# EAGLE design v0.2.0 (EAGLE 9.2.0)

## Sheet 1 of 3
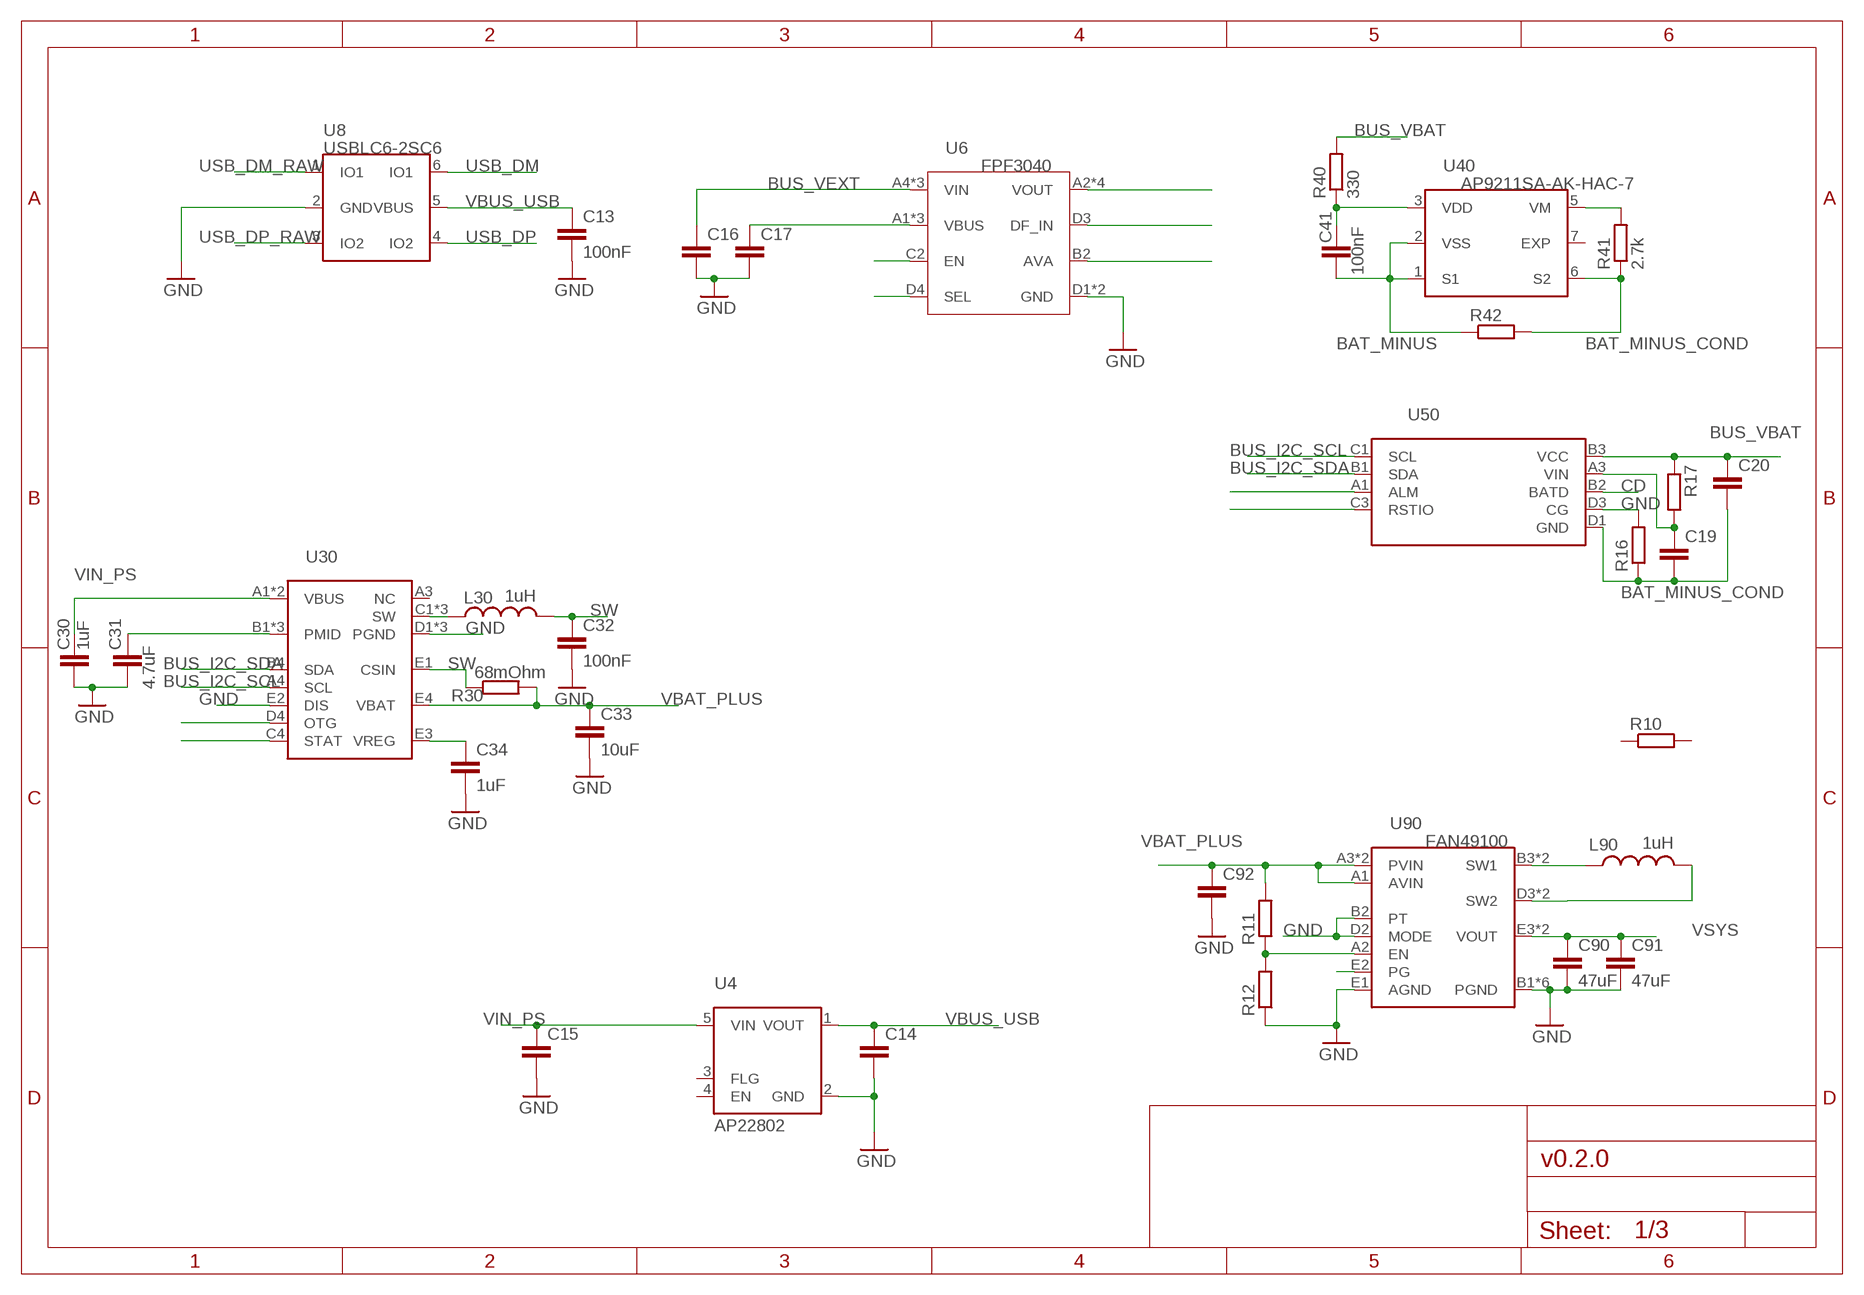
[diagram p0: schematic, sheet 1]

### Parts
C13  100nF  C-EUC0402  [C0402]
C14  C-EUC0603  [C0603]
C15  C-EUC0603  [C0603]
C16  C-EUC0603  [C0603]
C17  C-EUC0603  [C0603]
C19  C-EUC0402  [C0402]
C20  C-EUC0402  [C0402]
C30  1uF  C-EUC0402  [C0402]
C31  4.7uF  C-EUC0603  [C0603]
C32  100nF  C-EUC0402  [C0402]
C33  10uF  C-EUC0603  [C0603]
C34  1uF  C-EUC0402  [C0402]
C41  100nF  C-EUC0402  [C0402]
C90  47uF  C-EUC0805  [C0805]
C91  47uF  C-EUC0805  [C0805]
C92  C-EUC0805  [C0805]
L30  1uH  DJNR3015  [L3230M]
L90  1uH  DJNR3015  [L3230M]
R10  R-EU_R0603  [R0603]
R11  R-EU_R0402  [R0402]
R12  R-EU_R0402  [R0402]
R16  R-EU_R0805  [R0805]
R17  R-EU_R0402  [R0402]
R30  68mOhm  R-EU_R0805  [R0805]
R40  330  R-EU_R0402  [R0402]
R41  2.7k  R-EU_R0402  [R0402]
R42  R-EU_R0603  [R0603]
U4  AP22802  [SOT25]
U6  FPF3040  [BGA16C40P4X4_196X176X60]
U8  USBLC6-2SC6  [SOT95P280X110-6]
U30  FAN54015  [BGA20C40P4X5_196X187X55]
U40  AP9211SA-AK-HAC-7  [DFN200X300X60-7N]
U50  STC3115  [BGA12C40P4X3_137X201X65]
U90  FAN49100  [BGA20C40P4X5_201X161X60]

### Nets
BAT_MINUS: C41.2 R42.1 U40.1(S1) U40.2(VSS)
BAT_MINUS_COND: C19.2 C20.2 R16.1 R41.1 R42.2 U40.6(S2) U50.D1(GND)
BUS_I2C_SCL: U30.A4(SCL) U50.C1(SCL) ; also sheet 2,3
BUS_I2C_SDA: U30.B4(SDA) U50.B1(SDA) ; also sheet 2,3
BUS_VBAT: C20.1 R17.1 R40.2 U50.B3(VCC) ; also sheet 2
BUS_VEXT: C16.1 U6.A4(VIN) U6.B4(VIN) U6.C4(VIN) ; also sheet 2
CD: U50.B2(BATD)
GND: C13.2 C14.2 C15.2 C16.2 C17.2 C30.2 C31.2 C32.2 C33.2 C34.2 C90.2 C91.2 C92.2 R12.1 R16.2 U4.2(GND) U6.D1(GND) U6.D2(GND) U8.2(GND) U30.D1(PGND) U30.D2(PGND) U30.D3(PGND) U30.E2(DIS) U50.D3(CG) U90.B1(PGND) U90.B2(PT) U90.C1(PGND) U90.C2(PGND) U90.C3(PGND) U90.C4(PGND) U90.D1(PGND) U90.D2(MODE) U90.E1(AGND) ; also sheet 2,3
N$3: C41.1 R40.1 U40.3(VDD)
N$6: U6.A2(VOUT) U6.A3(VOUT) U6.B3(VOUT) U6.C3(VOUT)
N$7: C17.1 U6.A1(VBUS) U6.B1(VBUS) U6.C1(VBUS)
N$11: U6.C2(EN)
N$12: U6.D4(SEL)
N$13: U6.B2(AVA)
N$14: U6.D3(DF_IN)
N$15: U50.A1(ALM)
N$16: U50.C3(RSTIO)
N$17: R41.2 U40.5(VM)
N$18: L30.1 U30.C1(SW) U30.C2(SW) U30.C3(SW)
N$19: C31.1 U30.B1(PMID) U30.B2(PMID) U30.B3(PMID)
N$20: L90.2 U90.D3(SW2) U90.D4(SW2)
N$21: L90.1 U90.B3(SW1) U90.B4(SW1)
N$22: C19.1 R17.2 U50.A3(VIN)
N$23: C34.1 U30.E3(VREG)
N$24: R11.1 R12.2 U90.A2(EN)
N$25: U90.E2(PG)
N$28: U30.D4(OTG)
N$29: U30.C4(STAT)
SW: C32.1 L30.2 R30.1 U30.E1(CSIN)
USB_DM: U8.6(IO1) ; also sheet 3
USB_DM_RAW: U8.1(IO1) ; also sheet 2
USB_DP: U8.4(IO2) ; also sheet 3
USB_DP_RAW: U8.3(IO2) ; also sheet 2
VBAT_PLUS: C33.1 C92.1 R11.2 R30.2 U30.E4(VBAT) U90.A1(AVIN) U90.A3(PVIN) U90.A4(PVIN)
VBUS_USB: C13.1 C14.1 U4.1(VOUT) U8.5(VBUS) ; also sheet 2
VIN_PS: C15.1 C30.1 U4.5(VIN) U30.A1(VBUS) U30.A2(VBUS)
VSYS: C90.1 C91.1 U90.E3(VOUT) U90.E4(VOUT)
Unconnected: R10.1 R10.2 U4.3(FLG) U4.4(EN) U30.A3(NC)

## Sheet 2 of 3
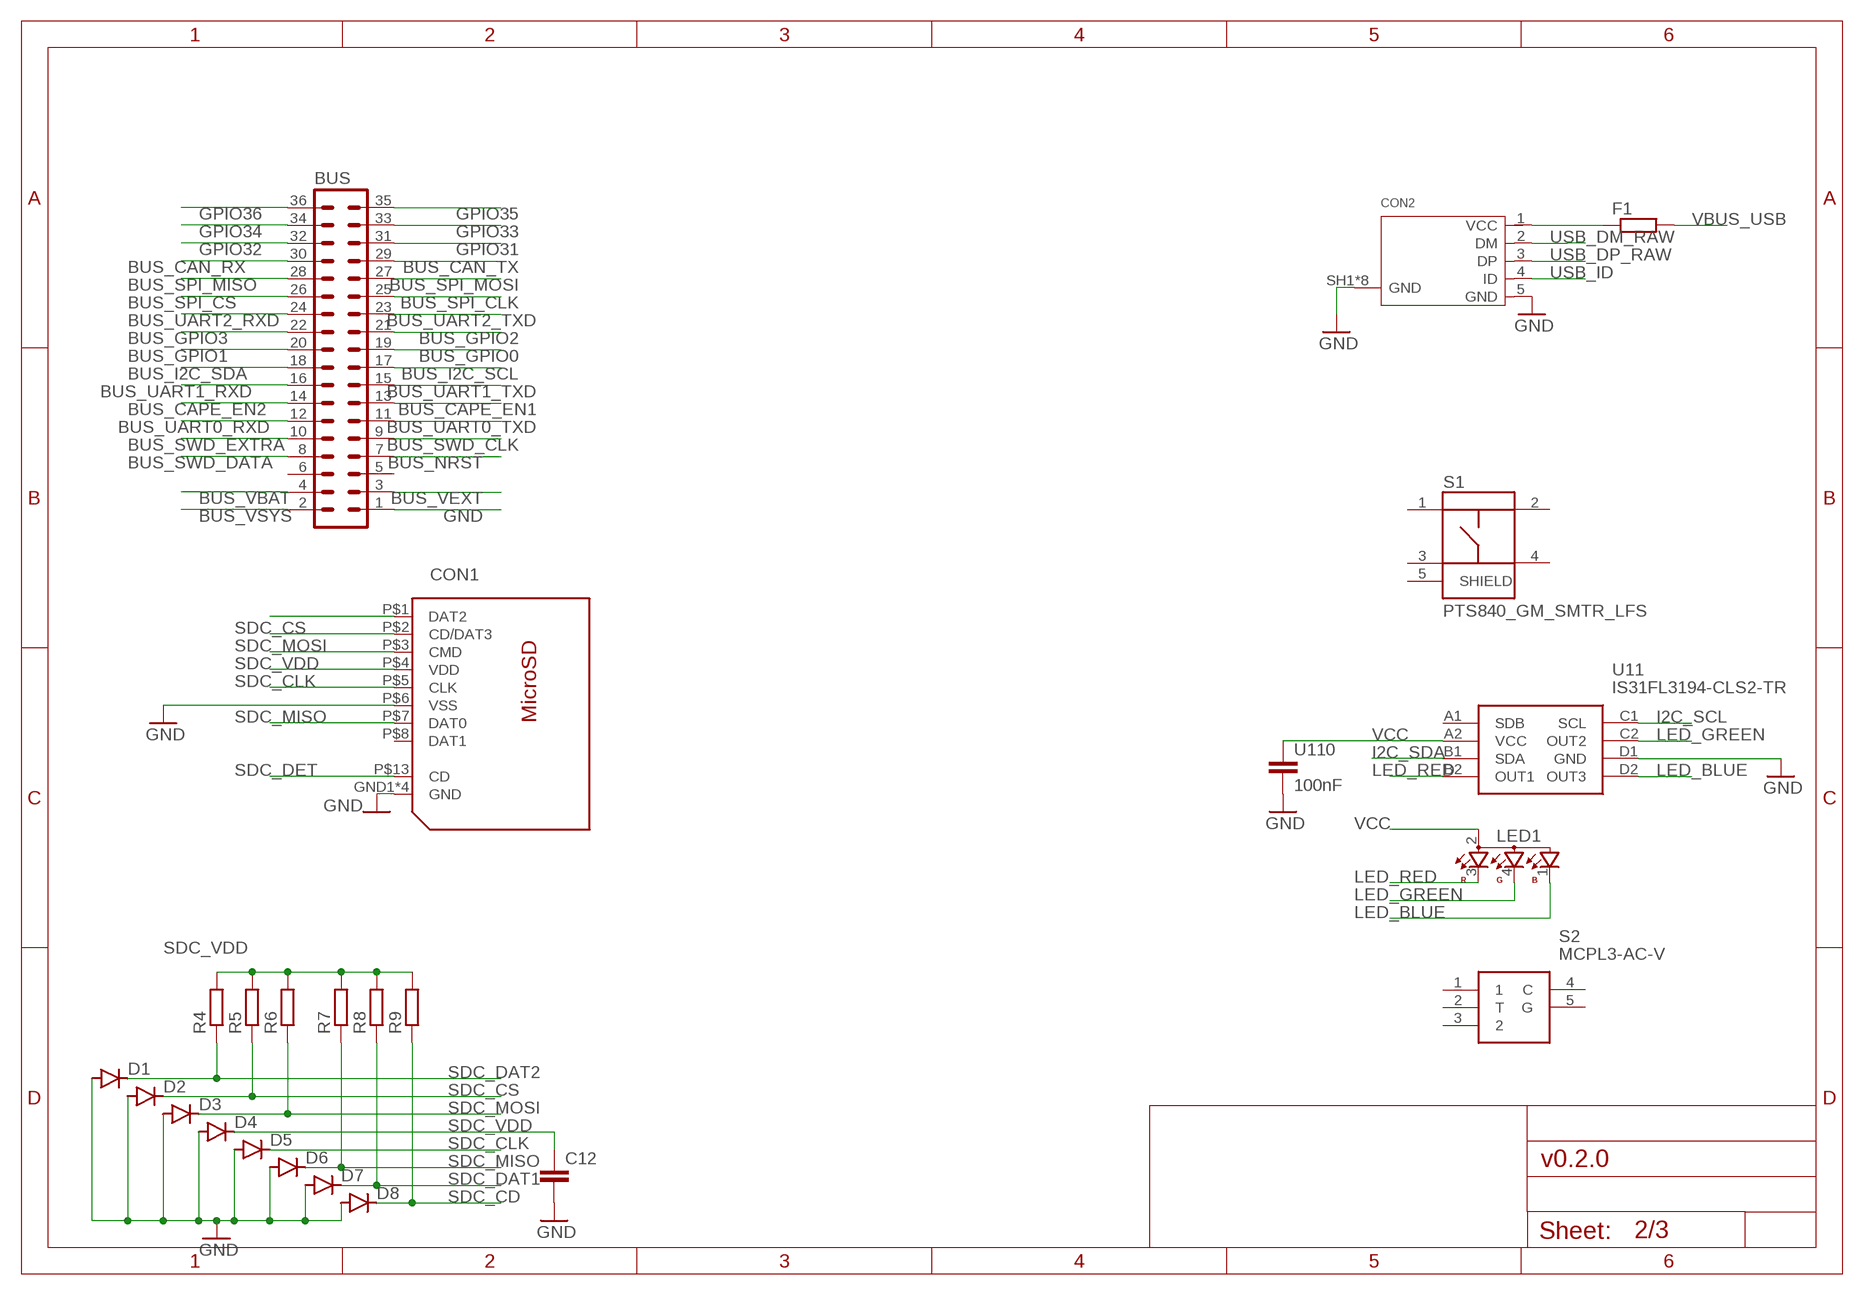
[diagram p1: schematic, sheet 2]

### Parts
BUS  MA18-2  [MA18-2]
C12  C-EUC0402  [C0402]
CON1  112J-TXAR  [112J]
CON2  10118194-0001LF  [10118194]
D1  DIODE-SOD523  [SOD523]
D2  DIODE-SOD523  [SOD523]
D3  DIODE-SOD523  [SOD523]
D4  DIODE-SOD523  [SOD523]
D5  DIODE-SOD523  [SOD523]
D6  DIODE-SOD523  [SOD523]
D7  DIODE-SOD523  [SOD523]
D8  DIODE-SOD523  [SOD523]
F1  R-EU_R0603  [R0603]
LED1  OSTB1204C1E  [321015RGB]
R4  R-EU_R0402  [R0402]
R5  R-EU_R0402  [R0402]
R6  R-EU_R0402  [R0402]
R7  R-EU_R0402  [R0402]
R8  R-EU_R0402  [R0402]
R9  R-EU_R0402  [R0402]
S1  PTS840_GM_SMTR_LFS  [SW_PTS840GMSMTRLFS]
S2  MCPL3-AC-V  [MCPL3-AC-V]
U11  IS31FL3194-CLS2-TR  [BGA8C40P2X4_99X159X42]
U110  100nF  C-EUC0402  [C0402]

### Nets
BUS_CAN_RX: BUS.30
BUS_CAN_TX: BUS.29
BUS_CAPE_EN1: BUS.13 ; also sheet 3
BUS_CAPE_EN2: BUS.14 ; also sheet 3
BUS_GPIO0: BUS.19 ; also sheet 3
BUS_GPIO1: BUS.20 ; also sheet 3
BUS_GPIO2: BUS.21 ; also sheet 3
BUS_GPIO3: BUS.22 ; also sheet 3
BUS_I2C_SCL: BUS.17 ; also sheet 1,3
BUS_I2C_SDA: BUS.18 ; also sheet 1,3
BUS_NRST: BUS.7 ; also sheet 3
BUS_SPI_CLK: BUS.25 ; also sheet 3
BUS_SPI_CS: BUS.26 ; also sheet 3
BUS_SPI_MISO: BUS.28 ; also sheet 3
BUS_SPI_MOSI: BUS.27 ; also sheet 3
BUS_SWD_CLK: BUS.9 ; also sheet 3
BUS_SWD_DATA: BUS.8 ; also sheet 3
BUS_SWD_EXTRA: BUS.10
BUS_UART0_RXD: BUS.12 ; also sheet 3
BUS_UART0_TXD: BUS.11 ; also sheet 3
BUS_UART1_RXD: BUS.16 ; also sheet 3
BUS_UART1_TXD: BUS.15 ; also sheet 3
BUS_UART2_RXD: BUS.24 ; also sheet 3
BUS_UART2_TXD: BUS.23 ; also sheet 3
BUS_VBAT: BUS.4 ; also sheet 1
BUS_VEXT: BUS.3 ; also sheet 1
BUS_VSYS: BUS.2
GND: BUS.1 C12.2 CON1.GND1(GND) CON1.GND2(GND) CON1.GND3(GND) CON1.GND4(GND) CON1.P$6(VSS) CON2.5(GND) CON2.SH1(GND) CON2.SH2(GND) CON2.SH3(GND) CON2.SH4(GND) CON2.SH5(GND) CON2.SH6(GND) CON2.SH7(GND) CON2.SH8(GND) D1.A D2.A D3.A D4.A D5.A D6.A D7.A D8.A U11.D1(GND) U110.2 ; also sheet 1,3
GPIO31: BUS.31 ; also sheet 3
GPIO32: BUS.32 ; also sheet 3
GPIO33: BUS.33 ; also sheet 3
GPIO34: BUS.34 ; also sheet 3
GPIO35: BUS.35 ; also sheet 3
GPIO36: BUS.36 ; also sheet 3
I2C_SCL: U11.C1(SCL)
I2C_SDA: U11.B1(SDA)
LED_BLUE: LED1.1 U11.D2(OUT3)
LED_GREEN: LED1.4 U11.C2(OUT2)
LED_RED: LED1.3 U11.B2(OUT1)
N$5: CON2.1(VCC) F1.1
N$9: CON1.P$1(DAT2)
SDC_CD: D8.C R9.1
SDC_CLK: CON1.P$5(CLK) D5.C ; also sheet 3
SDC_CS: CON1.P$2(CD/DAT3) D2.C R5.1 ; also sheet 3
SDC_DAT1: D7.C R8.1
SDC_DAT2: D1.C R4.1
SDC_DET: CON1.P$13(CD)
SDC_MISO: CON1.P$7(DAT0) D6.C R7.1 ; also sheet 3
SDC_MOSI: CON1.P$3(CMD) D3.C R6.1 ; also sheet 3
SDC_VDD: C12.1 CON1.P$4(VDD) D4.C R4.2 R5.2 R6.2 R7.2 R8.2 R9.2
USB_DM_RAW: CON2.2(DM) ; also sheet 1
USB_DP_RAW: CON2.3(DP) ; also sheet 1
USB_ID: CON2.4(ID)
VBUS_USB: F1.2 ; also sheet 1
VCC: LED1.2 U11.A2(VCC) U110.1
Unconnected: BUS.5 BUS.6 CON1.P$8(DAT1) S1.1 S1.2 S1.3 S1.4 S1.5(SHIELD) S2.1 S2.2(T) S2.3 S2.4(C) S2.5(G) U11.A1(SDB)

## Sheet 3 of 3
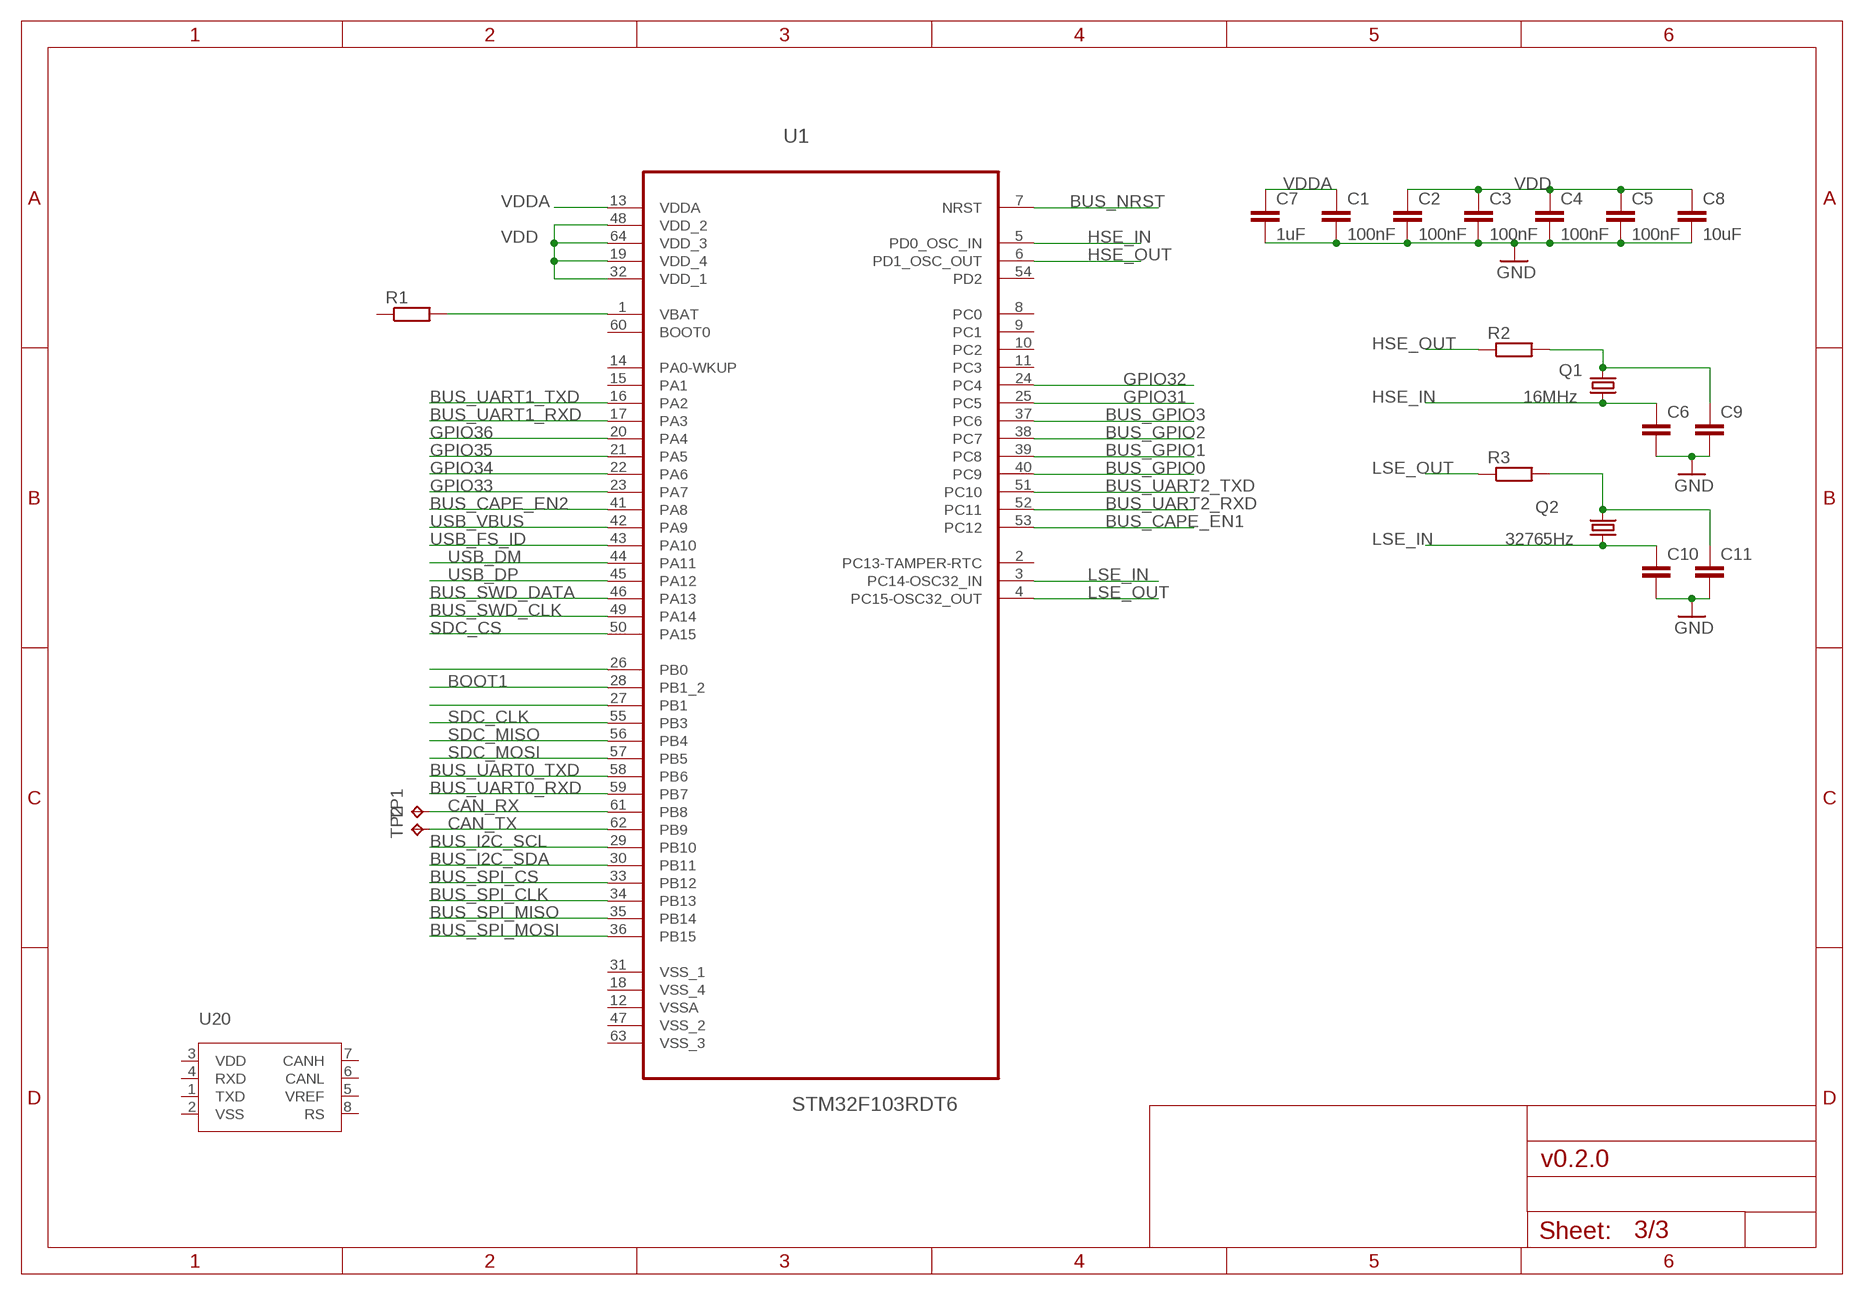
[diagram p2: schematic, sheet 3]

### Parts
C1  100nF  C-EUC0402  [C0402]
C2  100nF  C-EUC0402  [C0402]
C3  100nF  C-EUC0402  [C0402]
C4  100nF  C-EUC0402  [C0402]
C5  100nF  C-EUC0402  [C0402]
C6  C-EUC0402  [C0402]
C7  1uF  C-EUC0402  [C0402]
C8  10uF  C-EUC0603  [C0603]
C9  C-EUC0402  [C0402]
C10  C-EUC0402  [C0402]
C11  C-EUC0402  [C0402]
Q1  16MHz  KX-7  [3.2X2.5_KX-7]
Q2  32765Hz  KX-327-NHF  [3.2X1.5]
R1  R-EU_R0402  [R0402]
R2  R-EU_R0402  [R0402]
R3  R-EU_R0402  [R0402]
TP1  TPB1,27  [B1,27]
TP2  TPB1,27  [B1,27]
U1  STM32F103RDT6  [QFP50P1200X1200X160-64N]
U20  MCP2551  [SOIC8]

### Nets
BOOT1: U1.28(PB1_2)
BUS_CAPE_EN1: U1.53(PC12) ; also sheet 2
BUS_CAPE_EN2: U1.41(PA8) ; also sheet 2
BUS_GPIO0: U1.40(PC9) ; also sheet 2
BUS_GPIO1: U1.39(PC8) ; also sheet 2
BUS_GPIO2: U1.38(PC7) ; also sheet 2
BUS_GPIO3: U1.37(PC6) ; also sheet 2
BUS_I2C_SCL: U1.29(PB10) ; also sheet 1,2
BUS_I2C_SDA: U1.30(PB11) ; also sheet 1,2
BUS_NRST: U1.7(NRST) ; also sheet 2
BUS_SPI_CLK: U1.34(PB13) ; also sheet 2
BUS_SPI_CS: U1.33(PB12) ; also sheet 2
BUS_SPI_MISO: U1.35(PB14) ; also sheet 2
BUS_SPI_MOSI: U1.36(PB15) ; also sheet 2
BUS_SWD_CLK: U1.49(PA14) ; also sheet 2
BUS_SWD_DATA: U1.46(PA13) ; also sheet 2
BUS_UART0_RXD: U1.59(PB7) ; also sheet 2
BUS_UART0_TXD: U1.58(PB6) ; also sheet 2
BUS_UART1_RXD: U1.17(PA3) ; also sheet 2
BUS_UART1_TXD: U1.16(PA2) ; also sheet 2
BUS_UART2_RXD: U1.52(PC11) ; also sheet 2
BUS_UART2_TXD: U1.51(PC10) ; also sheet 2
CAN_RX: TP1.TP U1.61(PB8)
CAN_TX: TP2.TP U1.62(PB9)
GND: C1.2 C2.2 C3.2 C4.2 C5.2 C6.2 C7.2 C8.2 C9.2 C10.2 C11.2 ; also sheet 1,2
GPIO31: U1.25(PC5) ; also sheet 2
GPIO32: U1.24(PC4) ; also sheet 2
GPIO33: U1.23(PA7) ; also sheet 2
GPIO34: U1.22(PA6) ; also sheet 2
GPIO35: U1.21(PA5) ; also sheet 2
GPIO36: U1.20(PA4) ; also sheet 2
HSE_IN: C6.1 Q1.1 U1.5(PD0_OSC_IN)
HSE_OUT: R2.1 U1.6(PD1_OSC_OUT)
LSE_IN: C10.1 Q2.1 U1.3(PC14-OSC32_IN)
LSE_OUT: R3.1 U1.4(PC15-OSC32_OUT)
N$1: R1.2 U1.1(VBAT)
N$2: C9.1 Q1.3 R2.2
N$4: C11.1 Q2.2 R3.2
N$8: U1.26(PB0)
N$10: U1.27(PB1)
SDC_CLK: U1.55(PB3) ; also sheet 2
SDC_CS: U1.50(PA15) ; also sheet 2
SDC_MISO: U1.56(PB4) ; also sheet 2
SDC_MOSI: U1.57(PB5) ; also sheet 2
USB_DM: U1.44(PA11) ; also sheet 1
USB_DP: U1.45(PA12) ; also sheet 1
USB_FS_ID: U1.43(PA10)
USB_VBUS: U1.42(PA9)
VDD: C2.1 C3.1 C4.1 C5.1 C8.1 U1.19(VDD_4) U1.32(VDD_1) U1.48(VDD_2) U1.64(VDD_3)
VDDA: C1.1 C7.1 U1.13(VDDA)
Unconnected: R1.1 U1.2(PC13-TAMPER-RTC) U1.8(PC0) U1.9(PC1) U1.10(PC2) U1.11(PC3) U1.12(VSSA) U1.14(PA0-WKUP) U1.15(PA1) U1.18(VSS_4) U1.31(VSS_1) U1.47(VSS_2) U1.54(PD2) U1.60(BOOT0) U1.63(VSS_3) U20.1(TXD) U20.2(VSS) U20.3(VDD) U20.4(RXD) U20.5(VREF) U20.6(CANL) U20.7(CANH) U20.8(RS)

## Power pins joined to a net without a drawn wire
EXP: U40.7(EXP)

## Library data of the parts
BUS = con-lstb:MA18-2: PIN HEADER; OC_FARNELL: unknown; OC_NEWARK: unknown
C1-C17 C19 C20 C30-C34 C41 C90-C92 U110 = rcl:C-EU: CAPACITOR, European symbol; SPICEPREFIX: C
CON1 = parts-attend:112J-TXAR
CON2 = parts-amphenol:10118194-00
D1-D8 = diode:DIODE-: DIODE
F1 R1-R12 R16 R17 R30 R40-R42 = rcl:R-EU_: RESISTOR, European symbol; SPICEPREFIX: R
L30 L90 = parts-ferrocore:DJNR3015
LED1 = parts-optosupply:OSTB1204
Q1 = crystal-geyer_V1_0:KX: Quartz Crystals (MHz) SMD: KX - Serie Model Size l/w/h [mm] Frequency Range Frequency Stability Temp. Range [°C] Load Capacitance AECQ 200 availabel Datasheet KX-4 KX-5 KX-6 KX-7 KX-9A KX-9B KX-12A KX-12B KX-13 KX-20 KX-K KX-KS 1.6/1.2/0.3 2.0/1.6/0.45 2.5/2.0/0.55 3.2/2.5/0.8 5.0/3.2/1.0 5.0/3.2/1.1 6.0/3.5/1.1 6.0/3.5/1.0 7.0/5.0 /1.3 11.6/5.5/1.6 12.3/4.5/4.2 12.3/4.5/3.2 24.0 ~ 80.0 MHz 16.0 ~ 80.0 MHz 12.0 ~ 80.0 MHz 8.0 ~ 60.0 MHz 7,68 ~ 300,0 MHz 8,0 ~ 50,0 MHz 8,0 ~ 150,0 MHz 8,0 ~ 50,0 MHz 6,0 ~ 160,0 MHz 3,579 ~ 25,0 MHz 3,579 ~ 70,0 MHz 3,579 ~ 70,0 MHz ±10 … ±50ppm ±10 … ±50ppm ±10 … ±50ppm ±10 … ±50ppm ±10 … ±50ppm ±10 … ±50ppm ±10 … ±50ppm ±10 … ±50ppm ±10 … ±50ppm ±50ppm ±10 … ±50ppm ±10 … ±50ppm (*) -40°C …+85°C (*) -40°C …+125°C (*) -40°C …+125°C (*) -40°C …+125°C (*) -40°C …+105°C (*) -40°C …+105°C (*) -40°C …+125°C (*) -40°C …+105°C (*) -40°C …+105°C (*) -40°C …+105°C (*) -40°C …+85°C (*) -40°C …+85°C 8, 8…16 8, 8…16 10, 8…16 12, 7…20 16, 10…20 16, 10…20 16, 10…20 16, 12…20 16, 12…20 16, 12…20 16, 12…30 16, 12…30 - yes yes yes - - - - - - - - KX-4.pdf <http://www.geyer-electronic.de/uploads/tx_userartikelfrequenz/GEYER-KX-4.pdf> KX-5.pdf <http://www.geyer-electronic.de/uploads/tx_userartikelfrequenz/GEYER-KX-5.pdf> KX-6.pdf <http://www.geyer-electronic.de/uploads/tx_userartikelfrequenz/GEYER-KX-6.pdf> KX-7.pdf <http://www.geyer-electronic.de/uploads/tx_userartikelfrequenz/GEYER-KX-7.pdf> KX-9A.pdf <http://www.geyer-electronic.de/uploads/tx_userartikelfrequenz/GEYER-KX-9A.pdf> KX-9B.pdf <http://www.geyer-electronic.de/uploads/tx_userartikelfrequenz/GEYER-KX-9B.pdf> KX-12A.pdf <http://www.geyer-electronic.de/uploads/tx_userartikelfrequenz/GEYER-KX-12A.pdf> KX-12B.pdf <http://www.geyer-electronic.de/uploads/tx_userartikelfrequenz/GEYER-KX-12B.pdf> KX-13.pdf <http://www.geyer-electronic.de/uploads/tx_userartikelfrequenz/GEYER-KX-13.pdf> KX-20.pdf <http://www.geyer-electronic.de/uploads/tx_userartikelfrequenz/GEYER-KX-20.pdf> KX-K.pdf <http://www.geyer-electronic.de/uploads/tx_userartikelfrequenz/GEYER-KX-K.pdf> KX-KS.pdf <http://www.geyer-electronic.de/uploads/tx_userartikelfrequenz/GEYER-KX-KS.pdf> <http://www.geyer-electronic.de/fileadmin/template/img/logo-geyer-electronic.png> Details see: http://www.geyer-electronic.de/Frequenz-Produkte.9.0.html Created 2016-06-07, Hans Locher 2016 (C) Geyer Quartz Technology KX4,KX5,KX6,KX7,KX9A,KX9B,KX12A,KX12B,KX13,KX20,KXK,KXKS;1612;2016;2520;3225;5032;6035;7050;11655;12345;1,6x1,2;2,0x1,6;2,5x2,0;3,2x2,5;5,0x3,2;6,0x3,5;7,0x5,0;11,6x5,5;12,3x4,5;12,3x4,5;1.6x1.2;2.0x1.6;2.5x2.0;3.2x2.5;5.0x3.2;6.0x3.5;7.0x5.0;11.6x5.5;12.3x4.5;12.3x4.5;
Q2 = crystal-geyer_V1_0:KX-327: Tuning Fork Crystals (kHz) SMD: KX327 - Serie Model Size l/w/h [mm] Frequency Range Frequency Stability Temp. Range [°C] Load Capacitance AECQ 200 availabel Datasheet KX-327VT KX-327FT KX-327RT KX-327NHT KX-327NHF KX-327L KX-327S 1.25/1.05/0.5 1.6/1.0/0.5 2.0/1.2/0.6 3.2/1.5/0.8 3.2/1.5/0.8 7.0/1.5/1.4 8.2/3.8/2.5 32,768 kHz 32,768 kHz 32,768 kHz 32,768 kHz 32,768 kHz 32,768 kHz 32,768 kHz ±10 … ±20ppm ±10 … ±20ppm ±10 … ±20ppm ±10 … ±20ppm ±10 … ±20ppm ±10 … ±20ppm ±5 … ±20ppm (*) -40°C …+85°C (*) -40°C …+85°C (*) -40°C …+85°C (*) -40°C …+85°C (*) -40°C …+125°C (*) -40°C …+85°C (*) -40°C …+85°C 7/9/12,5 7/9/12,5 7/9/12,6 7/9/12,5 9/12,5 7/9/12,5 6/12,5 - - - - yes - - KX-327VT.pdf <http://www.geyer-electronic.de/uploads/tx_userartikelfrequenz/GEYER-KX-327VT.pdf> KX-327FT.pdf <http://www.geyer-electronic.de/uploads/tx_userartikelfrequenz/GEYER-KX-327FT.pdf> KX-327RT.pdf <http://www.geyer-electronic.de/uploads/tx_userartikelfrequenz/GEYER-KX-327RT.pdf> KX-327NHT.pdf <http://www.geyer-electronic.de/uploads/tx_userartikelfrequenz/GEYER-KX-327NHT.pdf> KX-327NHF.pdf <http://www.geyer-electronic.de/uploads/tx_userartikelfrequenz/GEYER-KX-327NHF.pdf> KX-327L.pdf <http://www.geyer-electronic.de/uploads/tx_userartikelfrequenz/GEYER-KX-327L.pdf> KX-327S.pdf <http://www.geyer-electronic.de/uploads/tx_userartikelfrequenz/GEYER-KX-327S.pdf> <http://www.geyer-electronic.de/fileadmin/template/img/logo-geyer-electronic.png> Details see: http://www.geyer-electronic.de/Frequenz-Produkte.9.0.html Created 2016-06-07, Hans Locher 2016 (C) Geyer Quartz Technology KX327VT,KX327FT,KX327RT,KX327NHT,KX327NHF,KX327S,KX327L;125105;1610;2012;3215;7015;8238;1,25x1,05,1.25x1.05;1,6x1,0,1.6x1.0;2,0x1,2,2.0x1.2;3,2x1,5,3.2x1.5;8,2x3,8,8.2x3.8,7.0x1.5,7,0x1,532.768kHz
S1 = parts_ck:PTS840_GM_SMTR_LFS: Switch Tactile N.O. SPST Button Gull Wing 0.05A 12VDC 100000Cycle 1.57N SMD T/R; AVAILABILITY: Unavailable; DESCRIPTION: Switch Tactile N.O. SPST Button Gull Wing 0.05A 12VDC 100000Cycle 1.57N SMD T/R; MF: C&K; MP: PTS840 GM SMTR LFS; PACKAGE: None; PRICE: None
S2 = multicomp:MCPL3-AC-V: MULTICOMP - MCPL3-AC-V - NAVIGATION SWITCH, 3WAY, SMD Source: Datasheet <http://www.farnell.com/datasheets/1673648.pdf>; ARROW_PART_NUMBER: MCPL3-AC-V; DESCRIPTION: MULTICOMP - MCPL3-AC-V - NAVIGATION SWITCH, 3WAY, SMD; HEIGHT: mm; MANUFACTURER_NAME: MULTICOMP; MANUFACTURER_PART_NUMBER: MCPL3-AC-V
TP1 TP2 = testpad:TP: Test pad
U1 = parts-st:STM32F103RDT6: ARM-based 32-bit MCU; AVAILABILITY: Unavailable; DESCRIPTION: Mainstream Performance line, ARM Cortex-M3 MCU with 384 Kbytes Flash, 72 MHz CPU, motor control, USB and CAN; MF: STMicroelectronics; MP: STM32F103RDT6; PACKAGE: LQFP-64 STMicroelectronics; PRICE: None
U4 = parts-diodes:AP22802
U6 = parts-onsemi:FPF3040
U8 = parts-st:USBLC6-2
U11 = parts-issi:IS31FL3194-CLS2-TR: LED Lighting Drivers 3-Channel Fun LED Driver Source: Datasheet <https://componentsearchengine.com/Datasheets/1/IS31FL3194-CLS2-TR.pdf>; DESCRIPTION: LED Lighting Drivers 3-Channel Fun LED Driver; HEIGHT: 0.422mm; MANUFACTURER_NAME: Integrated Silicon Solution Inc.; MANUFACTURER_PART_NUMBER: IS31FL3194-CLS2-TR; MOUSER_PART_NUMBER: 870-IS31FL3194CLS2TR
U20 = parts-microchip:MCP2551
U30 = parts-onsemi:FAN54015
U40 = parts-diodes:AP9211SA-AK-HAC-7: Battery Protection Li-Ion Packs 2.4V to 4.25V 6-Pin UDFN T/R; AVAILABILITY: Unavailable; DESCRIPTION: Battery Protection Li-Ion Packs 2.4V to 4.25V 6-Pin UDFN T/R; MF: Diodes Inc.; MP: AP9211SA-AK-HAC-7; PACKAGE: UDFN-6 Diodes Inc.; PRICE: None
U50 = parts-st:STC3115
U90 = parts-onsemi:FAN49100

## Board
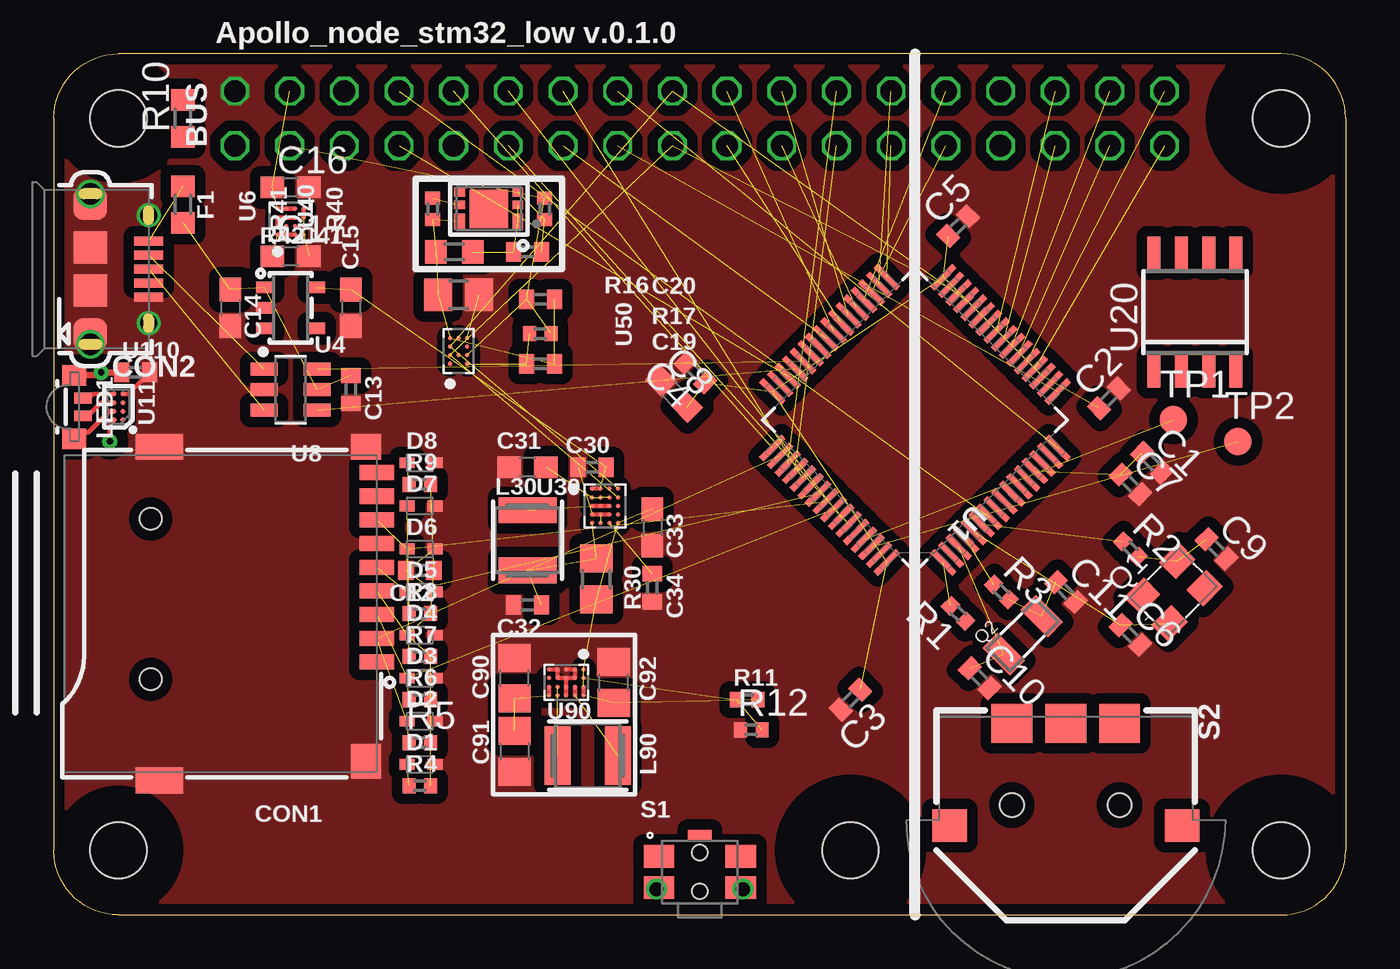
[diagram p3: board, top side]
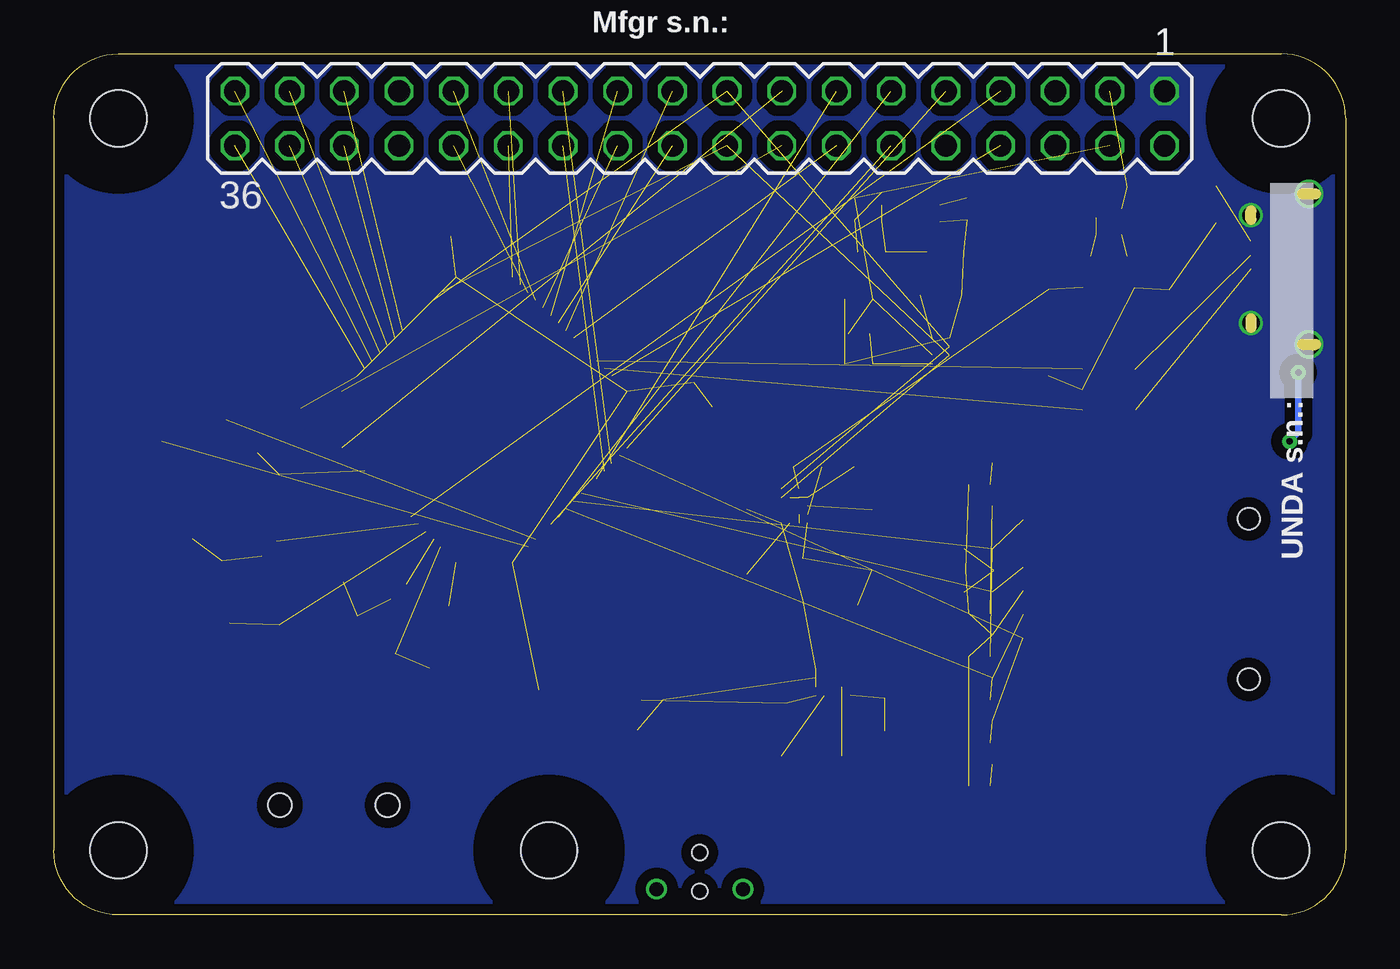
[diagram p4: board, bottom side, seen from below]

Size 60 x 40 mm. Coordinates in mm from the lower left corner, seen from the top.
Outline: 3,0 57,0 arc90 60,3 60,37 arc90 57,40 3,40 arc90 0,37 0,3 arc90 3,0
Copper layers (1*16): Top 0.035mm / dielectric 1mm / Bottom 0.035mm
Design rules "default *": minimum track width 0.2mm, minimum drill 0.3mm, track to track 0.16mm, track to pad 0.16mm, pad to pad 0.16mm, via to via 0.16mm, smd to smd 6mil, copper to edge 0.4mm, drill to drill 0.2mm, minimum pad ring 0.16mm, minimum via ring 0.2mm, stop-mask expansion 0.1mm, vias tented up to drill 0mil, thermal gap 10mil
Holes 2.6 mm at 3,57 77,57 57,3 3,37 37,3 3,3 57,37
tRestrict: area 0,54 to 6,60; area 74,54 to 80,60; area 54,0 to 60,6; area 0.5,34.5 to 5.5,39.5; area 34,0 to 40,6; area 0.5,0.5 to 5.5,5.5; area 54,34 to 60,40
bRestrict: area 0,54 to 6,60; area 74,54 to 80,60; area 54,0 to 60,6; area 0,34 to 6,40; area 34,0 to 40,6; area 0,0 to 6,6; area 54,34 to 60,40

### Footprints (pad centres in the part's own frame; a part is rotated, then mirrored left to right if it is on the bottom)
MA18-2 = drill 1.016 octagon: 1 -21.59,-1.27; 2 -21.59,1.27; 3 -19.05,-1.27; 4 -19.05,1.27; 5 -16.51,-1.27; 6 -16.51,1.27; 7 -13.97,-1.27; 8 -13.97,1.27; 9 -11.43,-1.27; 10 -11.43,1.27; 11 -8.89,-1.27; 12 -8.89,1.27; 13 -6.35,-1.27; 14 -6.35,1.27; 15 -3.81,-1.27; 16 -3.81,1.27; 17 -1.27,-1.27; 18 -1.27,1.27; 19 1.27,-1.27; 20 1.27,1.27; 21 3.81,-1.27; 22 3.81,1.27; 23 6.35,-1.27; 24 6.35,1.27; 25 8.89,-1.27; 26 8.89,1.27; 27 11.43,-1.27; 28 11.43,1.27; 29 13.97,-1.27; 30 13.97,1.27; 31 16.51,-1.27; 32 16.51,1.27; 33 19.05,-1.27; 34 19.05,1.27; 35 21.59,-1.27; 36 21.59,1.27
C0402 = smd 0.7 x 0.9: 1 -0.65,0; 2 0.65,0
C0603 = smd 1.1 x 1: 1 -0.85,0; 2 0.85,0
C0805 = smd 1.3 x 1.5: 1 -0.95,0; 2 0.95,0
112J = smd 1.2 x 1.4: GND1 -7.75,-0.5 | smd 1.2 x 2.2: GND2 -7.75,-10.1; GND3 7.75,-10.1 | smd 1.6 x 1.4: GND4 6.85,-0.5 | smd 0.7 x 1.6: P$1 2.25,0; P$2 1.15,0; P$3 0.05,0; P$4 -1.05,0; P$5 -2.15,0; P$6 -3.25,0; P$7 -4.35,0; P$8 -5.45,0; P$13 -6.55,0 | hole 1: -4.4,-10.5; 3.05,-10.5
10118194 = smd 0.4 x 1.35: 1 -1.3,2.7; 2 -0.65,2.7; 3 0,2.7; 4 0.65,2.7; 5 1.3,2.7 | drill 0.8: SH1 -2.5,2.7; SH2 2.5,2.7 | drill 1: SH3 -3.5,0; SH8 3.5,0 | smd 1.5 x 1.55: SH4 -3.05,0; SH5 -1,0; SH6 1,0; SH7 3.05,0
SOD523 = smd 0.7 x 0.5: A 0.7,0; C -0.6,0
R0603 = smd 1 x 1.1: 1 -0.85,0; 2 0.85,0
L3230M = smd 1.2 x 2.7: 1 -1.4,0; 2 1.4,0
321015RGB = smd 0.5 x 0.8: 1 -0.415,0.4; 4 0.415,0.4 | smd 0.95 x 1.1: 2 -1.475,0; 3 1.475,0
3.2X2.5_KX-7 = smd 1.3 x 1.1: 1 -1.15,-0.9; 2 1.15,-0.9; 3 1.15,0.9; 4 -1.15,0.9
3.2X1.5 = smd 1 x 1.8: 1 -1.25,0; 2 1.25,0
R0402 = smd 0.6 x 0.7: 1 -0.5,0; 2 0.5,0
R0805 = smd 1.3 x 1.5: 1 -0.95,0; 2 0.95,0
SW_PTS840GMSMTRLFS = smd 1.4 x 1.05: 1 -1.9,0.725; 2 1.9,0.725; 3 -1.9,-0.725; 4 1.9,-0.725 | smd 1.1 x 0.5: 5 0,1.7 | drill 0.65 pad 0.7: P$1 -2,-0.8; P$2 2,-0.8 | hole 0.7: 0,-0.9; 0,0.9
MCPL3-AC-V = smd 1.9 x 1.8: 1 -2.5,-0.9; 2 0,-0.9; 3 2.5,-0.9 | smd 1.6 x 1.5: 4 5.4,3.85; 5 -5.4,3.85 | hole 1.1: -2.5,2.9; 2.5,2.9
B1,27 = smd 1.27 x 1.27: TP 0,0
QFP50P1200X1200X160-64N = smd 1.473 x 0.279: 1 -5.613,3.759; 2 -5.613,3.251; 3 -5.613,2.743; 4 -5.613,2.261; 5 -5.613,1.753; 6 -5.613,1.245; 7 -5.613,0.762; 8 -5.613,0.254; 9 -5.613,-0.254; 10 -5.613,-0.762; 11 -5.613,-1.245; 12 -5.613,-1.753; 13 -5.613,-2.261; 14 -5.613,-2.743; 15 -5.613,-3.251; 16 -5.613,-3.759; 33 5.613,-3.759; 34 5.613,-3.251; 35 5.613,-2.743; 36 5.613,-2.261; 37 5.613,-1.753; 38 5.613,-1.245; 39 5.613,-0.762; 40 5.613,-0.254; 41 5.613,0.254; 42 5.613,0.762; 43 5.613,1.245; 44 5.613,1.753; 45 5.613,2.261; 46 5.613,2.743; 47 5.613,3.251; 48 5.613,3.759 | smd 0.279 x 1.473: 17 -3.759,-5.613; 18 -3.251,-5.613; 19 -2.743,-5.613; 20 -2.261,-5.613; 21 -1.753,-5.613; 22 -1.245,-5.613; 23 -0.762,-5.613; 24 -0.254,-5.613; 25 0.254,-5.613; 26 0.762,-5.613; 27 1.245,-5.613; 28 1.753,-5.613; 29 2.261,-5.613; 30 2.743,-5.613; 31 3.251,-5.613; 32 3.759,-5.613; 49 3.759,5.613; 50 3.251,5.613; 51 2.743,5.613; 52 2.261,5.613; 53 1.753,5.613; 54 1.245,5.613; 55 0.762,5.613; 56 0.254,5.613; 57 -0.254,5.613; 58 -0.762,5.613; 59 -1.245,5.613; 60 -1.753,5.613; 61 -2.261,5.613; 62 -2.743,5.613; 63 -3.251,5.613; 64 -3.759,5.613
SOT25 = smd 0.55 x 0.8: 1 -0.95,-1.2; 2 0,-1.2; 3 0.95,-1.2; 4 0.95,1.2; 5 -0.95,1.2
BGA16C40P4X4_196X176X60 = smd 0.2 x 0.2: A1 -0.6,0.6; A2 -0.2,0.6; A3 0.2,0.6; A4 0.6,0.6; B1 -0.6,0.2; B2 -0.2,0.2; B3 0.2,0.2; B4 0.6,0.2; C1 -0.6,-0.2; C2 -0.2,-0.2; C3 0.2,-0.2; C4 0.6,-0.2; D1 -0.6,-0.6; D2 -0.2,-0.6; D3 0.2,-0.6; D4 0.6,-0.6
SOT95P280X110-6 = smd 1.259 x 0.609: 1 -1.228,0.95; 2 -1.228,0; 3 -1.228,-0.95; 4 1.228,-0.95; 5 1.228,0; 6 1.228,0.95
BGA8C40P2X4_99X159X42 = smd 0.242 x 0.242: A1 -0.2,0.6; A2 0.2,0.6; B1 -0.2,0.2; B2 0.2,0.2; C1 -0.2,-0.2; C2 0.2,-0.2; D1 -0.2,-0.6; D2 0.2,-0.6
SOIC8 = smd 0.6 x 1.5: 1 -1.905,-2.75; 2 -0.635,-2.75; 3 0.635,-2.75; 4 1.905,-2.75; 5 1.905,2.75; 6 0.635,2.75; 7 -0.635,2.75; 8 -1.905,2.75
BGA20C40P4X5_196X187X55 = smd 0.2 x 0.2: A1 -0.6,0.8; A2 -0.2,0.8; A3 0.2,0.8; A4 0.6,0.8; B1 -0.6,0.4; B2 -0.2,0.4; B3 0.2,0.4; B4 0.6,0.4; C1 -0.6,0; C2 -0.2,0; C3 0.2,0; C4 0.6,0; D1 -0.6,-0.4; D2 -0.2,-0.4; D3 0.2,-0.4; D4 0.6,-0.4; E1 -0.6,-0.8; E2 -0.2,-0.8; E3 0.2,-0.8; E4 0.6,-0.8
DFN200X300X60-7N = smd 0.5 x 0.75: 1 -1.35,0.6; 6 1.35,0.6 | smd 0.5 x 0.4: 2 -1.35,-0.175; 3 -1.35,-0.775; 4 1.35,-0.775; 5 1.35,-0.175 | smd 1.8 x 1.8: 7 0,0
BGA12C40P4X3_137X201X65 = smd 0.2 x 0.2: A1 0.4,0.6; A3 -0.4,0.6; B1 0.4,0.2; B2 0,0.2; B3 -0.4,0.2; C1 0.4,-0.2; C3 -0.4,-0.2; D1 0.4,-0.6; D2 0,-0.6; D3 -0.4,-0.6
BGA20C40P4X5_201X161X60 = smd 0.2 x 0.2: A1 -0.6,0.8; A2 -0.2,0.8; A3 0.2,0.8; A4 0.6,0.8; B1 -0.6,0.4; B2 -0.2,0.4; B3 0.2,0.4; B4 0.6,0.4; C1 -0.6,0; C2 -0.2,0; C3 0.2,0; C4 0.6,0; D1 -0.6,-0.4; D2 -0.2,-0.4; D3 0.2,-0.4; D4 0.6,-0.4; E1 -0.6,-0.8; E2 -0.2,-0.8; E3 0.2,-0.8; E4 0.6,-0.8

### Placement (x,y rotation side)
BUS  30,37 180 bottom
C1  51,21 315 top
C2  49,24 45 top
C3  37,10 225 top
C4  29.8,25.2 135 top
C5  42,32 45 top
C6  50,13 315 top
C7  50,20 315 top
C8  28.8,24.2 135 top
C9  54,17 315 top
C10  43,11 315 top
C11  47,15 315 top
C12  17,16 180 top
C13  13.8,24.4 270 top
C14  8.2,28.2 270 top
C15  13.8,28.2 270 top
C16  11,33.8 0 top
C17  11,30.6 0 top
C19  22.6,25.6 0 top
C20  22.6,28.6 0 top
C30  25,20.8 180 top
C31  22,20.8 180 top
C32  22,14.4 180 top
C33  27.8,18 270 top
C34  27.8,15.2 270 top
C41  22,30.8 180 top
C90  21.4,11 90 top
C91  21.4,7.6 270 top
C92  26,10.8 90 top
CON1  15,14 270 top
CON2  1.7,30 270 top
D1  17,7 0 top
D2  17,9 0 top
D3  17,11 0 top
D4  17,13 0 top
D5  17,15 0 top
D6  17,17 0 top
D7  17,19 0 top
D8  17,21 0 top
F1  6,33 270 top
L30  22,17.4 270 top
L90  24.8,7.4 180 top
LED1  0.95,23.6 270 top
Q1  52,15 45 top
Q2  45,13 45 top
R1  42,14 135 top
R2  50,17 315 top
R3  44,15 315 top
R4  17,6 0 top
R5  17,8 0 top
R6  17,10 0 top
R7  17,12 0 top
R8  17,14 0 top
R9  17,20 0 top
R10  6,37 90 top
R11  32.2,10 0 top
R12  32.4,8.6 0 top
R16  18.8,28.8 0 top
R17  22.6,27 180 top
R30  25.2,15.6 270 top
R40  22.8,32.8 90 top
R41  17.6,32.8 90 top
R42  18.6,30.8 180 top
S1  30,2 0 top
S2  47,8 180 top
TP1  52,23 0 top
TP2  55,22 0 top
U1  40,23 135 top
U4  11,28.2 270 top
U6  11,32.2 90 top
U8  11,24.4 0 top
U11  3,23.6 180 top
U20  53,28 0 top
U30  25.6,19 0 top
U40  20.2,32.8 180 top
U50  18.8,26.2 180 top
U90  23.8,10.8 270 top
U110  3.8,25.2 0 top

### Tracks (layer width: path | path; a pad name or v marks a point on that pad's centre or on a via)
BAT_MINUS  (3 unrouted)
BAT_MINUS_COND  (6 unrouted)
BUS_CAPE_EN1  (1 unrouted)
BUS_CAPE_EN2  (1 unrouted)
BUS_GPIO0  (1 unrouted)
BUS_GPIO1  (1 unrouted)
BUS_GPIO2  (1 unrouted)
BUS_GPIO3  (1 unrouted)
BUS_I2C_SCL  (3 unrouted)
BUS_I2C_SDA  (3 unrouted)
BUS_NRST  (1 unrouted)
BUS_SPI_CLK  (1 unrouted)
BUS_SPI_CS  (1 unrouted)
BUS_SPI_MISO  (1 unrouted)
BUS_SPI_MOSI  (1 unrouted)
BUS_SWD_CLK  (1 unrouted)
BUS_SWD_DATA  (1 unrouted)
BUS_UART0_RXD  (1 unrouted)
BUS_UART0_TXD  (1 unrouted)
BUS_UART1_RXD  (1 unrouted)
BUS_UART1_TXD  (1 unrouted)
BUS_UART2_RXD  (1 unrouted)
BUS_UART2_TXD  (1 unrouted)
BUS_VBAT  (4 unrouted)
BUS_VEXT  (2 unrouted)
  Top 0.2: U6.C4 U6.B4 U6.A4
CAN_RX  (1 unrouted)
CAN_TX  (1 unrouted)
GND  (8 unrouted)
  Top 0.2: U11.D1 3.45,24.2 U110.2 | 11.6,32.8 11.6,32.4 | U90.E1 U90.D1 U90.D2 U90.C2 | U90.C4 U90.C3 U90.C2 | U90.C1 U90.B1 U90.B2 U90.C2 | U30.D3 U30.D2 U30.D1
  pour Bottom (isolate 0.5, rank 6, no thermals): -2,-2 -2,42 62,42 62,-2
  pour Top (isolate 0.5, no thermals): -4,-4 -4,44 64,44 64,-4
GPIO31  (1 unrouted)
GPIO32  (1 unrouted)
GPIO33  (1 unrouted)
GPIO34  (1 unrouted)
GPIO35  (1 unrouted)
GPIO36  (1 unrouted)
HSE_IN  (2 unrouted)
HSE_OUT  (1 unrouted)
LED_BLUE
  Top 0.2: U11.D2 1.8,24.2 1.61,24.02 LED1.1
LED_GREEN
  Top 0.2: U11.C2 2.2,23.8 1.58,23.18 LED1.4
LED_RED
  Top 0.2: U11.B2 2.6,23.4 1.6,22.4 1.23,22.4 LED1.3
LSE_IN  (2 unrouted)
LSE_OUT  (1 unrouted)
N$1  (1 unrouted)
N$2  (2 unrouted)
N$3  (2 unrouted)
N$4  (2 unrouted)
N$5  (1 unrouted)
N$6
  Top 0.2: U6.C3 U6.B3 U6.A3 U6.A2
N$7  (1 unrouted)
  Top 0.2: U6.A1 U6.B1 U6.C1
N$17  (1 unrouted)
N$18  (1 unrouted)
  Top 0.2: U30.C3 U30.C2 U30.C1
N$19  (3 unrouted)
N$20  (2 unrouted)
N$21  (1 unrouted)
  Top 0.2: U90.B3 U90.B4
N$22  (2 unrouted)
N$23  (1 unrouted)
N$24  (2 unrouted)
SDC_CD  (1 unrouted)
SDC_CLK  (2 unrouted)
SDC_CS  (3 unrouted)
SDC_DAT1  (1 unrouted)
SDC_DAT2  (1 unrouted)
SDC_MISO  (3 unrouted)
SDC_MOSI  (3 unrouted)
SDC_VDD  (8 unrouted)
SW  (3 unrouted)
USB_DM  (1 unrouted)
USB_DM_RAW  (1 unrouted)
USB_DP  (1 unrouted)
USB_DP_RAW  (1 unrouted)
VBAT_PLUS  (6 unrouted)
  Top 0.2: U90.A3 U90.A4
VBUS_USB  (4 unrouted)
VCC  (via drill 0.3)
  Top 0.2: v2.6,22 2.6,22.8 U11.A2
  Top 0.3: U110.1 v2.2,25.2 2.08,25.07 LED1.2
  Bottom 0.3: v2.2,25.2 2.2,22.4 v2.6,22
VDD  (8 unrouted)
VDDA  (2 unrouted)
VIN_PS  (3 unrouted)
  Top 0.2: U30.A2 U30.A1
VSYS  (2 unrouted)
  Top 0.2: U90.E3 U90.E4

### Text on the board
tPlace: Apollo_node_stm32_low v.0.1.0
bPlace: Mfgr s.n.: | UNDA s.n.: